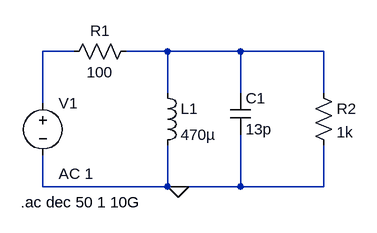
[diagram p0: schematic freq-bpf-primero.asc]
freq-bpf-primero.asc, the LTspice schematic file:
Version 4
SHEET 1 880 680
WIRE -48 96 -96 96
WIRE 96 96 32 96
WIRE 208 96 96 96
WIRE 336 96 208 96
WIRE 96 160 96 96
WIRE 208 160 208 96
WIRE 336 160 336 96
WIRE -96 176 -96 96
WIRE -96 304 -96 256
WIRE 96 304 96 240
WIRE 96 304 -96 304
WIRE 112 304 96 304
WIRE 208 304 208 224
WIRE 208 304 112 304
WIRE 336 304 336 240
WIRE 336 304 208 304
FLAG 112 304 0
SYMBOL voltage -96 160 R0
WINDOW 123 24 124 Left 2
WINDOW 39 0 0 Left 0
SYMATTR InstName V1
SYMATTR Value ""
SYMATTR Value2 AC 1
SYMBOL ind 80 144 R0
SYMATTR InstName L1
SYMATTR Value 470µ
SYMBOL cap 192 160 R0
SYMATTR InstName C1
SYMATTR Value 13p
SYMBOL res -64 112 R270
WINDOW 0 32 56 VTop 2
WINDOW 3 0 56 VBottom 2
SYMATTR InstName R1
SYMATTR Value 100
SYMBOL res 320 144 R0
SYMATTR InstName R2
SYMATTR Value 1k
TEXT -130 328 Left 2 !.ac dec 50 1 10G

The netlist it stands for:
* freq-bpf-primero.asc
V1 N001 0 AC 1
L1 N002 0 470µ
C1 N002 0 13p
R1 N001 N002 100
R2 N002 0 1k
.ac dec 50 1 10G
.backanno
.end